# Altium schematic sheet Lab1Schemat.SchDoc
size A4
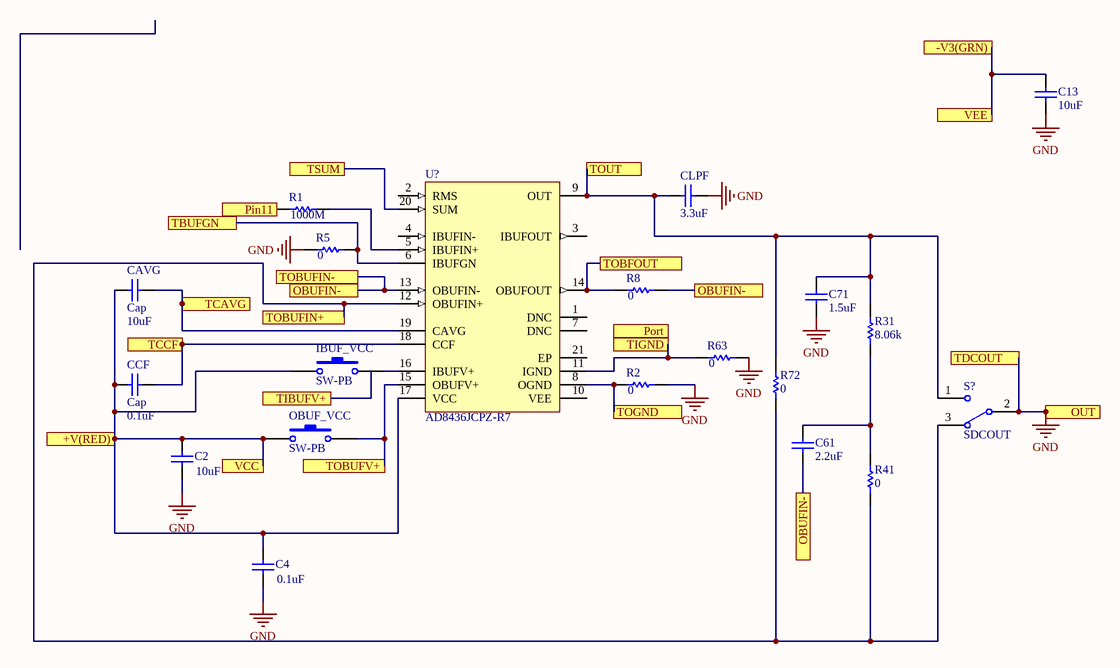
[diagram p0: Lab1Schemat.SchDoc]

## Parts
C2  value 10uF  [RAD-0.3]  (hidden comment: Cap)
C4  value 0.1uF  [RAD-0.3]  (hidden comment: Cap)
C13  value 10uF  [RAD-0.3]  (hidden comment: Cap)
C61  value 2.2uF  [RAD-0.3]  (hidden comment: Cap)
C71  value 1.5uF  [RAD-0.3]  (hidden comment: Cap)
CAVG  Cap  value 10uF  [RAD-0.3]
CCF  Cap  value 0.1uF  [RAD-0.3]
CLPF  value 3.3uF  [RAD-0.3]  (hidden comment: Cap)
IBUF_VCC  SW-PB  [SPST-2]
OBUF_VCC  SW-PB  [SPST-2]
R1  value 1000M  [AXIAL-0.3]  (hidden comment: Res1)
R2  value 0  [AXIAL-0.3]  (hidden comment: Res1)
R5  value 0  [AXIAL-0.3]  (hidden comment: Res1)
R8  value 0  [AXIAL-0.3]  (hidden comment: Res1)
R31  value 8.06k  [AXIAL-0.3]  (hidden comment: Res1)
R41  value 0  [AXIAL-0.3]  (hidden comment: Res1)
R63  value 0  [AXIAL-0.3]  (hidden comment: Res1)
R72  value 0  [AXIAL-0.3]  (hidden comment: Res1)
S?  SDCOUT  [TL36WW15050]
U?  AD8436JCPZ-R7  [ADI-CP-20-10_N]

## Ports
+V(RED), -V3(GRN), OBUFIN-, OUT, Pin11, Port, TBUFGN, TCAVG, TCCF, TDCOUT, TIBUFV+, TIGND, TOBFOUT, TOBUFIN+, TOBUFIN-, TOBUFV+, TOGND, TOUT, TSUM, VCC, VEE

## Nets
GND: C2.1 C4.1 C13.2 C71.2 CLPF.2 R2.2 R5.1 R63.2 S?.2 ; port TDCOUT, port OUT
+V(RED): C2.2 C4.2 CAVG.1 CCF.1 IBUF_VCC.1 OBUF_VCC.1 U?.17(VCC) ; port VCC, port +V(RED)
-V3(GRN): C13.1 ; port -V3(GRN), port VEE
OBUFIN-: C61.2 R8.2 U?.13(OBUFIN-) ; port OBUFIN-, port TOBUFIN-
Pin11: R1.1 ; port Pin11
TBUFGN: R5.2 U?.6(IBUFGN) ; port TBUFGN
TCAVG: CAVG.2 U?.19(CAVG) ; port TCAVG
TCCF: CCF.2 U?.18(CCF) ; port TCCF
TIGND: R63.1 U?.11(IGND) ; port TIGND
TOBFOUT: R8.1 U?.14(OBUFOUT) ; port TOBFOUT
TOBUFIN+: R41.1 R72.1 S?.3 U?.12(OBUFIN+) ; port TOBUFIN+
TOBUFV+: OBUF_VCC.2 U?.15(OBUFV+) ; port TOBUFV+
TOGND: R2.1 U?.8(OGND) ; port TOGND
TOUT: C71.1 CLPF.1 R31.2 R72.2 S?.1 U?.9(OUT) ; port TOUT
TSUM: U?.20(SUM) ; port TSUM
NetC61_1: C61.1 R31.1 R41.2
NetIBUF_VCC_2: IBUF_VCC.2 U?.16(IBUFV+)
NetR1_2: R1.2 U?.5(IBUFIN+)

Not connected (* = marked no-connect by the designer): U? 1(DNC) 2(RMS) 3(IBUFOUT) 4(IBUFIN-) 7(DNC) 10(VEE) 21(EP)

## Library data of the parts
C2 C4 C13 C61 C71 CAVG CCF CLPF = Cap: Capacitor; Published: 8-Jun-2000; LatestRevisionDate: 17-Jul-2002; LatestRevisionNote: Re-released for DXP Platform.; PackageReference: RAD-0.3; Publisher: Altium Limited; PackageDescription: Radial Cap, Thru-Hole; 2 Leads; 0.3 in Pin Spacing
IBUF_VCC OBUF_VCC = SW-PB: Switch; Published: 24-Mar-1999; LatestRevisionDate: 17-Jul-2002; LatestRevisionNote: Re-released for DXP Platform.; PackageReference: SPST-2; Publisher: Altium Limited; PackageDescription: Switch; 2 Leads
R1 R2 R5 R8 R31 R41 R63 R72 = Res1: Resistor; Published: 8-Jun-2000; LatestRevisionDate: 17-Jul-2002; LatestRevisionNote: Re-released for DXP Platform.; PackageReference: AXIAL-0.3; Publisher: Altium Limited; PackageDescription: Axial Device, Thru-Hole; 2 Leads; 0.3 in Pin Spacing
S? = SW-SPDT: SPDT Subminiature Toggle Switch, Right Angle Mounting, Vertical Actuation; Published: 24-Mar-1999; LatestRevisionDate: 17-Dec-2003; LatestRevisionNote: Schematic revised, PCB Footprint replaced.; DatasheetVersion: 05-Dec-2000; PackageReference: TL36WW15050; Publisher: Altium Limited; PackageDescription: Switch; 4 Leads; ComponentLink1Description: Manufacturer Link; ComponentLink1URL: http://www.apem.com
U? = CMP-0527-00006-3: Low Cost, Low Power, True RMS-to-DC Converter, 4.8 to 36 V Single Supply, 0 to 70 degC, 20-Pin QFN (CP-20-10); Manufacturer: Analog Devices; V Span (min): 4.8 V; Max Vin (V-rms): 3 V rms; Error (%@ CF: 3)=0.5; V Span (max): 36 V; -3dB Bandwidth: 950 KHz; Supply Current: 300 uA; PartNumber: AD8436JCPZ-R7; ComponentLink2Description: Datasheet; PackageDescription: 20-Pin Frame Chip Scale Package, Body 4 x 4 mm, Pitch 0.5 mm; ComponentLink3Description: Package Specification; PackageReference: CP-20-10; PackageVersion: Rev. B; ComponentLink1URL: http://www.analog.com/; RoHS: TRUE; DatasheetVersion: Rev. B; ComponentLink1Description: Manufacturer URL; ComponentLink3URL: http://www.analog.com/static/imported-files/packages/PKG_PDF/LFCSP(CP)/CP_20_10.pdf; Mounting Technology: Surface Mount; ComponentLink2URL: http://www.analog.com/static/imported-files/data_sheets/AD8436.pdf; Operating Temperature Range: 0 to 70 degC